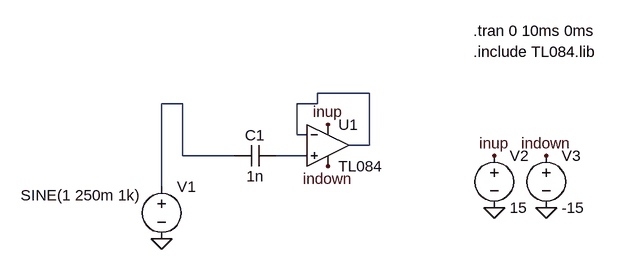
[diagram p0: schematic 04-Suiv.asc]
04-Suiv.asc, the LTspice schematic file:
Version 4
SHEET 1 880 680
WIRE 208 80 128 80
WIRE -80 96 -112 96
WIRE 128 96 128 80
WIRE 128 96 96 96
WIRE 96 144 96 96
WIRE 112 144 96 144
WIRE 208 160 208 80
WIRE 208 160 176 160
WIRE -80 176 -80 96
WIRE 0 176 -80 176
WIRE 112 176 64 176
WIRE -112 224 -112 96
FLAG -112 304 0
FLAG 400 256 0
FLAG 480 256 0
FLAG 400 176 inup
FLAG 144 128 inup
FLAG 480 176 indown
FLAG 144 192 indown
SYMBOL Opamps\\opamp2 144 96 R0
SYMATTR InstName U1
SYMATTR Value TL084
SYMBOL cap 64 160 R90
WINDOW 0 0 32 VBottom 2
WINDOW 3 32 32 VTop 2
SYMATTR InstName C1
SYMATTR Value 1n
SYMBOL voltage -112 208 R0
WINDOW 3 -217 29 Left 2
WINDOW 123 0 0 Left 0
WINDOW 39 0 0 Left 0
SYMATTR Value SINE(1 250m 1k)
SYMATTR InstName V1
SYMBOL voltage 400 160 R0
WINDOW 123 0 0 Left 0
WINDOW 39 0 0 Left 0
SYMATTR InstName V2
SYMATTR Value 15
SYMBOL voltage 480 160 R0
WINDOW 123 0 0 Left 0
WINDOW 39 0 0 Left 0
SYMATTR InstName V3
SYMATTR Value -15
TEXT 368 -16 Left 2 !.tran 0 10ms 0ms
TEXT 368 16 Left 2 !.include TL084.lib

The netlist it stands for:
* 04-Suiv.asc
XU1 N003 N001 inup indown N001 TL084  ; pins In+ In- V+ V- OUT
C1 N003 N002 1n
V1 N002 0 SINE(1 250m 1k)
V2 inup 0 15
V3 indown 0 -15
.tran 0 10ms 0ms
.include TL084.lib
.backanno
.end